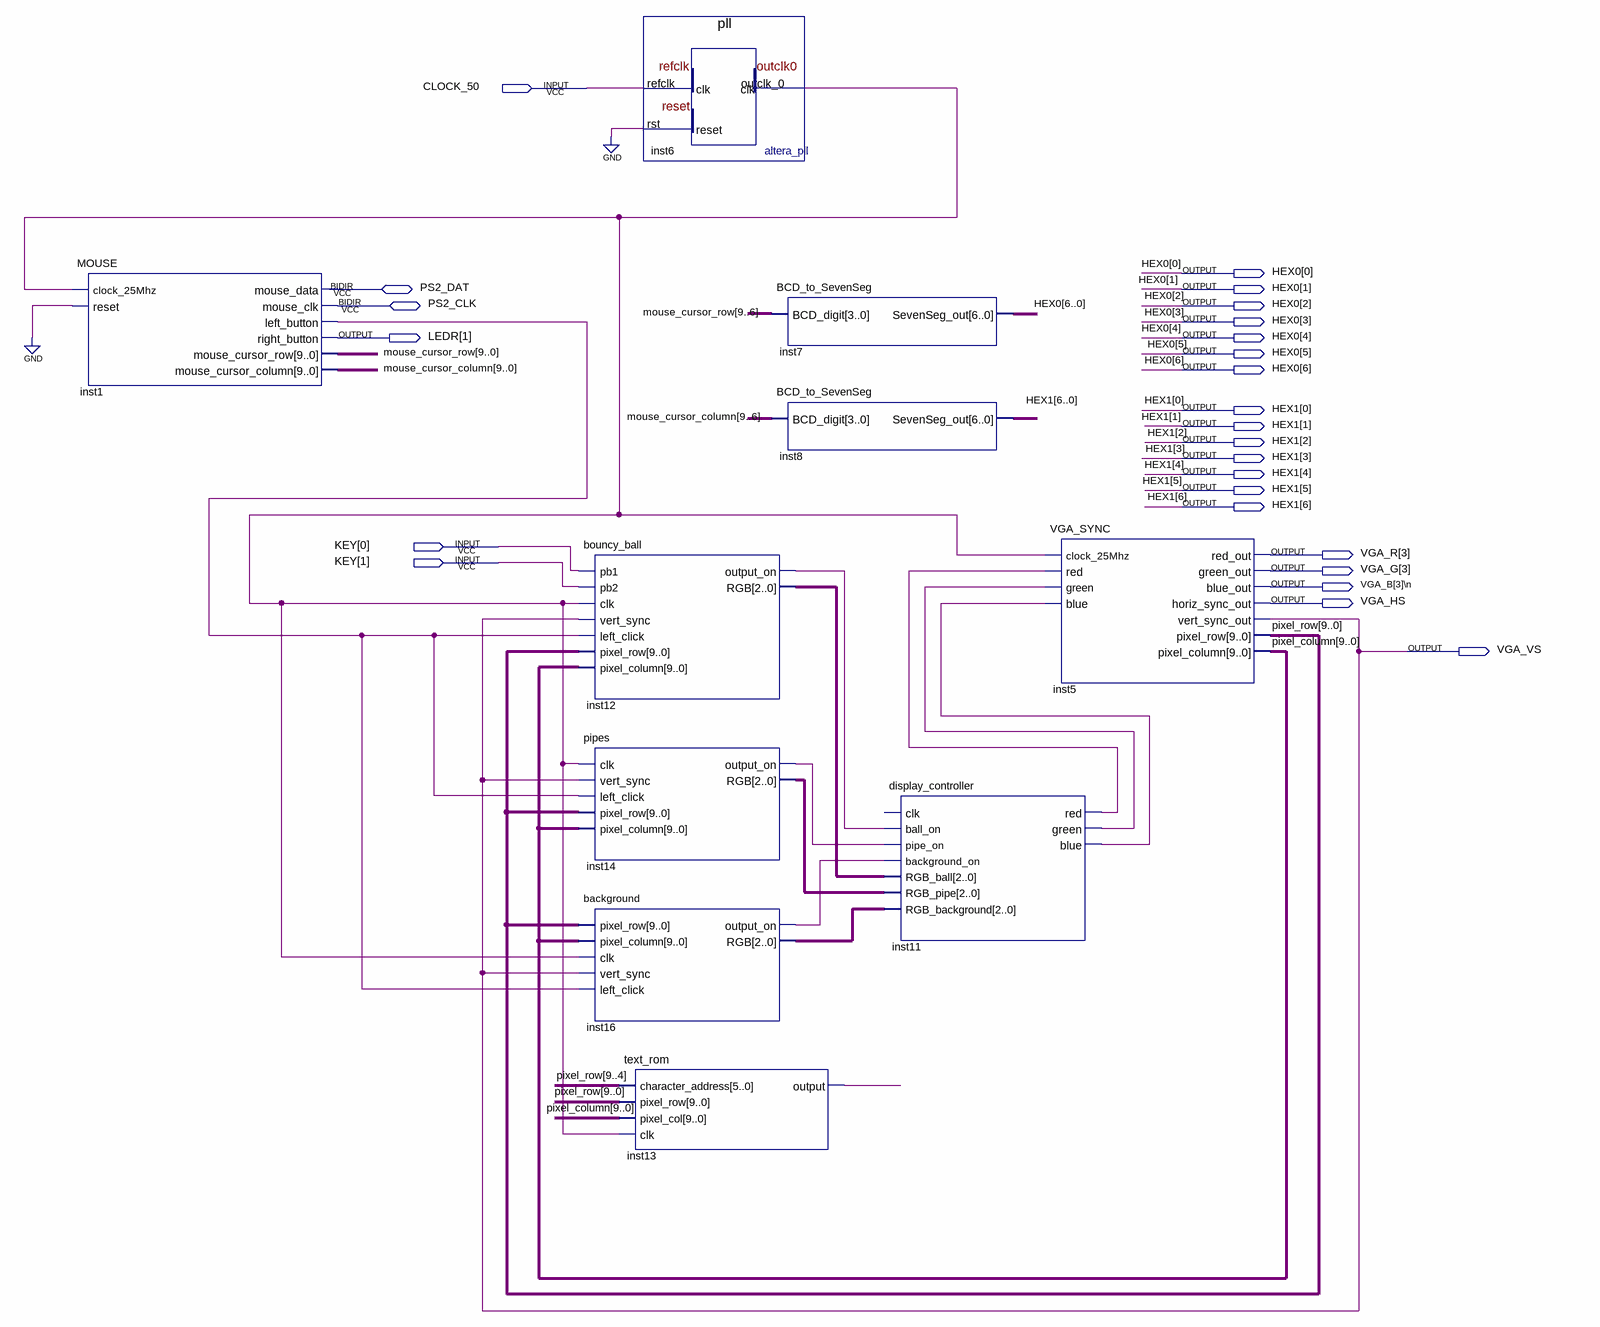
[diagram p0: schematic sheet]
// Quartus schematic flappybird21block.bdf as structural Verilog: 10 symbols, 25 pins
module flappybird21block (
  input  CLOCK_50,
  input  [1:0] KEY,
  inout  PS2_DAT,
  inout  PS2_CLK,
  output [6:0] HEX0,
  output [1:1] LEDR,
  output [6:0] HEX1,
  output [3:3] VGA_R,
  output [3:3] VGA_G,
  output \VGA_B[3]\n ,
  output VGA_HS,
  output VGA_VS
);

  wire inst1_left_button, inst6_outclk_0, inst11_blue, inst11_green, inst11_red, inst12_output_on,
       inst13_output, inst14_output_on, inst16_output_on;
  wire [2:0] inst12_rgb, inst14_rgb, inst16_rgb;
  wire [9:0] mouse_cursor_column, mouse_cursor_row, pixel_column, pixel_row;

  MOUSE inst1 (
    .clock_25Mhz(inst6_outclk_0), .reset(1'b0), .left_button(inst1_left_button), .right_button(LEDR[1]),
    .mouse_cursor_row(mouse_cursor_row), .mouse_cursor_column(mouse_cursor_column), .mouse_data(PS2_DAT),
    .mouse_clk(PS2_CLK));
  bouncy_ball inst12 (
    .pb1(KEY[0]), .pb2(KEY[1]), .clk(inst6_outclk_0), .vert_sync(VGA_VS), .left_click(inst1_left_button),
    .pixel_row(pixel_row), .pixel_column(pixel_column), .output_on(inst12_output_on), .RGB(inst12_rgb));
  pipes inst14 (
    .clk(inst6_outclk_0), .vert_sync(VGA_VS), .left_click(inst1_left_button), .pixel_row(pixel_row),
    .pixel_column(pixel_column), .output_on(inst14_output_on), .RGB(inst14_rgb));
  background inst16 (
    .pixel_row(pixel_row), .pixel_column(pixel_column), .clk(inst6_outclk_0), .vert_sync(VGA_VS),
    .left_click(inst1_left_button), .output_on(inst16_output_on), .RGB(inst16_rgb));
  pll inst6 (.refclk(CLOCK_50), .rst(1'b0), .outclk_0(inst6_outclk_0));
  text_rom inst13 (
    .character_address(pixel_row[9:4]), .pixel_row(pixel_row), .pixel_col(pixel_column),
    .clk(inst6_outclk_0), .\output (inst13_output));
  BCD_to_SevenSeg inst7 (.BCD_digit(mouse_cursor_row[9:6]), .SevenSeg_out(HEX0));
  BCD_to_SevenSeg inst8 (.BCD_digit(mouse_cursor_column[9:6]), .SevenSeg_out(HEX1));
  display_controller inst11 (
    .ball_on(inst12_output_on), .pipe_on(inst14_output_on), .background_on(inst16_output_on),
    .RGB_ball(inst12_rgb), .RGB_pipe(inst14_rgb), .RGB_background(inst16_rgb), .red(inst11_red),
    .green(inst11_green), .blue(inst11_blue));  // open: clk
  VGA_SYNC inst5 (
    .clock_25Mhz(inst6_outclk_0), .red(inst11_red), .green(inst11_green), .blue(inst11_blue),
    .red_out(VGA_R[3]), .green_out(VGA_G[3]), .blue_out(\VGA_B[3]\n ), .horiz_sync_out(VGA_HS),
    .vert_sync_out(VGA_VS), .pixel_row(pixel_row), .pixel_column(pixel_column));
endmodule
